# EAGLE design LedTile (EAGLE 7.4.0)
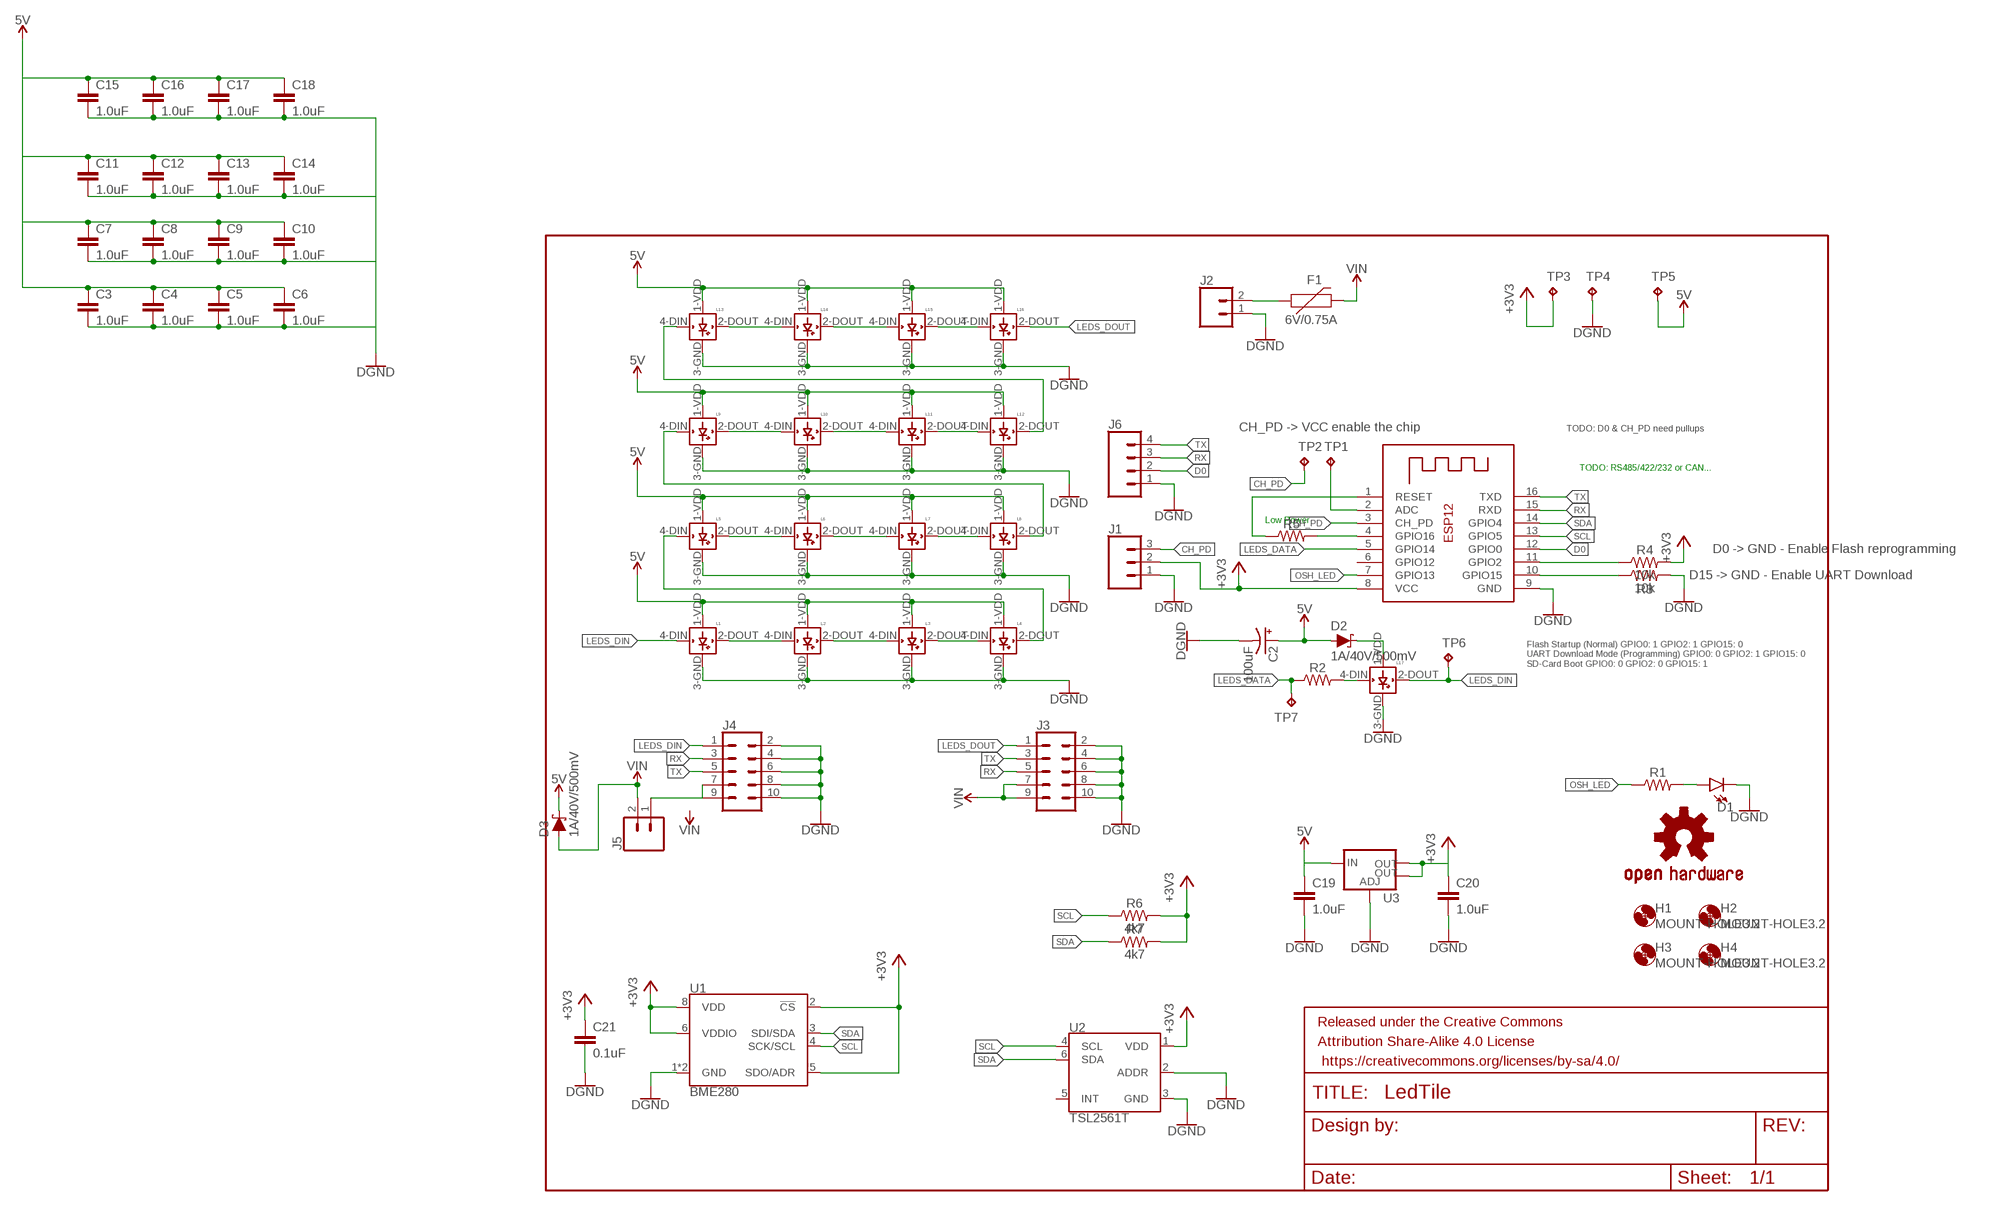
[diagram p0: schematic, sheet 1]

## Parts
C2  100uF  100UF-POLAR-EIA7343-10V-10%(TANT)  [EIA7343]
C3  1.0uF  1.0UF-0805-25V-(+80/-20%)  [0805]
C4  1.0uF  1.0UF-0805-25V-(+80/-20%)  [0805]
C5  1.0uF  1.0UF-0805-25V-(+80/-20%)  [0805]
C6  1.0uF  1.0UF-0805-25V-(+80/-20%)  [0805]
C7  1.0uF  1.0UF-0805-25V-(+80/-20%)  [0805]
C8  1.0uF  1.0UF-0805-25V-(+80/-20%)  [0805]
C9  1.0uF  1.0UF-0805-25V-(+80/-20%)  [0805]
C10  1.0uF  1.0UF-0805-25V-(+80/-20%)  [0805]
C11  1.0uF  1.0UF-0805-25V-(+80/-20%)  [0805]
C12  1.0uF  1.0UF-0805-25V-(+80/-20%)  [0805]
C13  1.0uF  1.0UF-0805-25V-(+80/-20%)  [0805]
C14  1.0uF  1.0UF-0805-25V-(+80/-20%)  [0805]
C15  1.0uF  1.0UF-0805-25V-(+80/-20%)  [0805]
C16  1.0uF  1.0UF-0805-25V-(+80/-20%)  [0805]
C17  1.0uF  1.0UF-0805-25V-(+80/-20%)  [0805]
C18  1.0uF  1.0UF-0805-25V-(+80/-20%)  [0805]
C19  1.0uF  1.0UF-0805-25V-(+80/-20%)  [0805]
C20  1.0uF  1.0UF-0805-25V-(+80/-20%)  [0805]
C21  0.1uF  1.0UF-0805-25V-(+80/-20%)  [0805]
D1  LED1206-BOTTOM  [LED-1206-BOTTOM]
D2  1A/40V/500mV  DIODE-SCHOTTKY-SS14  [SMA-DIODE]
D3  1A/40V/500mV  DIODE-SCHOTTKY-SS14  [SMA-DIODE]
F1  6V/0.75A  PPTC_THREE-QUARTER-AMP  [1206]
FRAME1  FRAME-LETTER  [CREATIVE_COMMONS]
H1  MOUNT-HOLE3.2  [3,2]
H2  MOUNT-HOLE3.2  [3,2]
H3  MOUNT-HOLE3.2  [3,2]
H4  MOUNT-HOLE3.2  [3,2]
J1  CONN_031X03_NO_SILK  [1X03_NO_SILK]
J2  CONN_025MM  [SCREWTERMINAL-5MM-2]
J3  CONN_05X2RA  [2X5-RA]
J4  CONN_05X2RA  [2X5-RA]
J5  CONN_02  [1X02]
J6  CONN_04  [1X04]
L1  WS2812B  [WS2812B]
L2  WS2812B  [WS2812B]
L3  WS2812B  [WS2812B]
L4  WS2812B  [WS2812B]
L5  WS2812B  [WS2812B]
L6  WS2812B  [WS2812B]
L7  WS2812B  [WS2812B]
L8  WS2812B  [WS2812B]
L9  WS2812B  [WS2812B]
L10  WS2812B  [WS2812B]
L11  WS2812B  [WS2812B]
L12  WS2812B  [WS2812B]
L13  WS2812B  [WS2812B]
L14  WS2812B  [WS2812B]
L15  WS2812B  [WS2812B]
L16  WS2812B  [WS2812B]
L17  WS2812B  [WS2812B]
LOGO1  OSHW-LOGOL  [OSHW-LOGO-L]
R1  RESISTOR0805  [0805]
R2  RESISTOR0805  [0805]
R3  10k  RESISTOR0805  [0805]
R4  10k  RESISTOR0805  [0805]
R5  RESISTOR0805  [0805]
R6  4k7  RESISTOR0805  [0805]
R7  4k7  RESISTOR0805  [0805]
TP1  TPTP12R  [TP12R]
TP2  TPTP12R  [TP12R]
TP3  TPTP12R  [TP12R]
TP4  TPTP12R  [TP12R]
TP5  TPTP12R  [TP12R]
TP6  TPTP12R  [TP12R]
TP7  TPTP12R  [TP12R]
U1  BME280  [LGA-8-2.5X2.5]
U2  TSL2561T  [TMB-6]
U3  V_REG_LM1117SOT223  [SOT223]
X1  ESP-12  [ESP-12]

## Nets
5V: C2.A(+) C3.1 C4.1 C5.1 C6.1 C7.1 C8.1 C9.1 C10.1 C11.1 C12.1 C13.1 C14.1 C15.1 C16.1 C17.1 C18.1 C19.1 D2.A D3.C L1.1-VDD(VDD) L2.1-VDD(VDD) L3.1-VDD(VDD) L4.1-VDD(VDD) L5.1-VDD(VDD) L6.1-VDD(VDD) L7.1-VDD(VDD) L8.1-VDD(VDD) L9.1-VDD(VDD) L10.1-VDD(VDD) L11.1-VDD(VDD) L12.1-VDD(VDD) L13.1-VDD(VDD) L14.1-VDD(VDD) L15.1-VDD(VDD) L16.1-VDD(VDD) TP5.TP U3.3(IN)
+3V3: C20.1 C21.1 J1.2 R4.2 R6.2 R7.2 TP3.TP U1.2(!CS) U1.5(SDO/ADR) U1.6(VDDIO) U1.8(VDD) U2.1(VDD) U3.2(OUT) U3.4(OUT) X1.8(VCC)
CH_PD: J1.3 TP2.TP X1.3(CH_PD)
D0: J6.2 X1.12(GPIO0)
GND: C2.C(-) C3.2 C4.2 C5.2 C6.2 C7.2 C8.2 C9.2 C10.2 C11.2 C12.2 C13.2 C14.2 C15.2 C16.2 C17.2 C18.2 C19.2 C20.2 C21.2 D1.C J1.1 J2.1 J3.2 J3.4 J3.6 J3.8 J3.10 J4.2 J4.4 J4.6 J4.8 J4.10 J6.1 L1.3-GND(GND) L2.3-GND(GND) L3.3-GND(GND) L4.3-GND(GND) L5.3-GND(GND) L6.3-GND(GND) L7.3-GND(GND) L8.3-GND(GND) L9.3-GND(GND) L10.3-GND(GND) L11.3-GND(GND) L12.3-GND(GND) L13.3-GND(GND) L14.3-GND(GND) L15.3-GND(GND) L16.3-GND(GND) L17.3-GND(GND) R3.2 TP4.TP U1.1(GND) U1.7(GND) U2.2(ADDR) U2.3(GND) U3.1(ADJ) X1.9(GND) ; supply symbol labelled DGND
LEDS_DATA: R2.1 TP7.TP X1.5(GPIO14)
LEDS_DIN: J4.1 L1.4-DIN(DIN) L17.2-DOUT(DOUT) TP6.TP
LEDS_DOUT: J3.1 L16.2-DOUT(DOUT)
N$1: L1.2-DOUT(DOUT) L2.4-DIN(DIN)
N$2: L2.2-DOUT(DOUT) L3.4-DIN(DIN)
N$3: L4.2-DOUT(DOUT) L5.4-DIN(DIN)
N$4: D2.C L17.1-VDD(VDD)
N$5: TP1.TP X1.2(ADC)
N$6: L17.4-DIN(DIN) R2.2
N$7: L3.2-DOUT(DOUT) L4.4-DIN(DIN)
N$8: L13.2-DOUT(DOUT) L14.4-DIN(DIN)
N$9: L14.2-DOUT(DOUT) L15.4-DIN(DIN)
N$10: L15.2-DOUT(DOUT) L16.4-DIN(DIN)
N$11: L11.2-DOUT(DOUT) L12.4-DIN(DIN)
N$12: L12.2-DOUT(DOUT) L13.4-DIN(DIN)
N$13: L8.2-DOUT(DOUT) L9.4-DIN(DIN)
N$14: L10.2-DOUT(DOUT) L11.4-DIN(DIN)
N$15: L9.2-DOUT(DOUT) L10.4-DIN(DIN)
N$16: L5.2-DOUT(DOUT) L6.4-DIN(DIN)
N$17: L6.2-DOUT(DOUT) L7.4-DIN(DIN)
N$18: L7.2-DOUT(DOUT) L8.4-DIN(DIN)
N$19: R3.1 X1.10(GPIO15)
N$20: R4.1 X1.11(GPIO2)
N$24: R5.2 X1.4(GPIO16)
N$25: R5.1 X1.1(RESET)
N$26: D1.A R1.2
N$27: J4.7 J4.9 J5.1
N$28: F1.1 J2.2
OSH_LED: R1.1 X1.7(GPIO13)
RX: J3.5 J4.3 J6.3 X1.15(RXD)
SCL: R6.1 U1.4(SCK/SCL) U2.4(SCL) X1.13(GPIO5)
SDA: R7.1 U1.3(SDI/SDA) U2.6(SDA) X1.14(GPIO4)
TX: J3.3 J4.5 J6.4 X1.16(TXD)
VIN: D3.A F1.2 J3.7 J3.9 J5.2
Unconnected: U2.5(INT) X1.6(GPIO12)

## Notes on the sheet
- CH_PD -> VCC enable the chip | TODO: D0 & CH_PD need pullups
- TODO: RS485/422/232 or CAN...
- Low Power
- D0 -> GND - Enable Flash reprogramming
- D15 -> GND - Enable UART Download
- Flash Startup (Normal) GPIO0: 1 GPIO2: 1 GPIO15: 0
  UART Download Mode (Programming) GPIO0: 0 GPIO2: 1 GPIO15: 0
  SD-Card Boot GPIO0: 0 GPIO2: 0 GPIO15: 1

## Library data of the parts
C2 = SparkFun-Capacitors:100UF-POLAR: 100µF polarized capacitors A capacitor is a passive two-terminal electrical component used to store electrical energy temporarily in an electric field.; PROD_ID: CAP-07890
C3-C20 = SparkFun-Capacitors:1.0UF: 1µF ceramic capacitors A capacitor is a passive two-terminal electrical component used to store electrical energy temporarily in an electric field.; PROD_ID: CAP-11625
C21 = SparkFun-Capacitors:1.0UF: 1µF ceramic capacitors A capacitor is a passive two-terminal electrical component used to store electrical energy temporarily in an electric field.; PROD_ID: CAP-11625; VALUE: 1.0uF
D1 = SparkFun-LED:LED: LED (Generic) Standard schematic elements and footprints for 5mm, 3mm, 1206, and 0603 sized LEDs. Generic LEDs with no color specified.
D2 D3 = SparkFun-DiscreteSemi:DIODE-SCHOTTKY: Schottky diode A Schottky diode is a semiconductor diode which has a low forward voltage drop and a very fast switching action.; PROD_ID: DIO-08053
F1 = SparkFun-Fuses:PPTC: Resettable Fuse PPTC Resettable Fuse. Really a sort of resistor with a polymeric positive temperature coefficient whose resistance increases dramatically with an increase in temperature. When heated by the power passing through the resistance rises causing the current to be limited, protecting the circuit. This is achieved by the transition of the polymer from a crystalline to an amorphous state where the conductive carbon separates breaking the conductive pathways found in the cool crystalline structure. When a PPTC cools back down it resumes conducting letting the circuit turn back on. SparkFun Products: SparkFun RedBoard - Programmed with Arduino <https://www.sparkfun.com/products/12757> Pro Micro - 5V/16MHz <https://www.sparkfun.com/products/12640> Arduino Pro 328 - 5V/16MHz <https://www.sparkfun.com/products/10915> MP3 Trigger <https://www.sparkfun.com/products/13720>; PROD_ID: RES-11150
FRAME1 = SparkFun-Aesthetics:FRAME-LETTER: Schematic Frame - Letter Standard 8.5x11 US Letter frame
H1-H4 = holes:MOUNT-HOLE: MOUNTING HOLE with drill center marker
J1 = SparkFun-Connectors:CONN_03: Multi connection point. Often used as Generic Header-pin footprint for 0.1 inch spaced/style header connections On any of the 0.1 inch spaced packages, you can populate with these: Break Away Headers - Straight <https://www.sparkfun.com/products/116> (PRT-00116) Break Away Male Headers - Right Angle <https://www.sparkfun.com/products/553> (PRT-00553) Female Headers <https://www.sparkfun.com/products/115> (PRT-00115) Break Away Headers - Machine Pin <https://www.sparkfun.com/products/117> (PRT-00117) Break Away Female Headers - Swiss Machine Pin <https://www.sparkfun.com/products/743> (PRT-00743) Stackable Header - 3 Pin (Female, 0.1") <https://www.sparkfun.com/products/13875> (PRT-13875) For SCREWTERMINALS and SPRING TERMINALS visit here: Screw Terimnals on SparkFun.com <https://www.sparkfun.com/search/results?term=Screw+Terminals> (5mm/3.5mm/2.54mm spacing) This device is also useful as a general connection point to wire up your design to another part of your project. Our various solder wires solder well into these plated through hole pads. Hook-Up Wire - Assortment (Stranded, 22 AWG) <https://www.sparkfun.com/products/11375> (PRT-11375) Hook-Up Wire - Assortment (Solid Core, 22 AWG) <https://www.sparkfun.com/products/11367> (PRT-11367) View the entire wire category on our website here <https://www.sparkfun.com/categories/141> Special notes: Molex polarized connector foot print use with SKU : PRT-08232 with associated crimp pins and housings.
J2 = SparkFun-Connectors:CONN_02: Multi connection point. Often used as Generic Header-pin footprint for 0.1 inch spaced/style header connections On any of the 0.1 inch spaced packages, you can populate with these: Break Away Headers - Straight <https://www.sparkfun.com/products/116> (PRT-00116) Break Away Male Headers - Right Angle <https://www.sparkfun.com/products/553> (PRT-00553) Female Headers <https://www.sparkfun.com/products/115> (PRT-00115) Break Away Headers - Machine Pin <https://www.sparkfun.com/products/117> (PRT-00117) Break Away Female Headers - Swiss Machine Pin <https://www.sparkfun.com/products/743> (PRT-00743) For SCREWTERMINALS and SPRING TERMINALS visit here: Screw Terimnals on SparkFun.com <https://www.sparkfun.com/search/results?term=Screw+Terminals> (5mm/3.5mm/2.54mm spacing) This device is also useful as a general connection point to wire up your design to another part of your project. Our various solder wires solder well into these plated through hole pads. Hook-Up Wire - Assortment (Stranded, 22 AWG) <https://www.sparkfun.com/products/11375> (PRT-11375) Hook-Up Wire - Assortment (Solid Core, 22 AWG) <https://www.sparkfun.com/products/11367> (PRT-11367) View the entire wire category on our website here <https://www.sparkfun.com/categories/141> Special notes: Molex polarized connector foot print use with: PRT-08233 with associated crimp pins and housings. 2.54_SCREWTERM for use with PRT-10571. 3.5mm Screw Terminal footprints for PRT-08084 5mm Screw Terminal footprints for use with PRT-08432; SF_SKU: PRT-08432
J3 J4 = SparkFun-Connectors:CONN_05X2: Multi connection point. Often used as Generic Header-pin footprint for 0.1 inch spaced/style header connections For AVR SPI programming port, see special device with nice symbol: "AVR_SPI_PROG_5x2.dev" You can populate with any combo of single row headers, but if you'd like an exact match, check these: 2x5 AVR ICSP Male Header <https://www.sparkfun.com/products/778> (PRT-00778) 2x5 Pin Shrouded Header <https://www.sparkfun.com/products/8506> (PRT-08506) On any of the 0.1 inch spaced packages, you can populate with these: Break Away Headers - Straight <https://www.sparkfun.com/products/116> (PRT-00116) Break Away Male Headers - Right Angle <https://www.sparkfun.com/products/553> (PRT-00553) Female Headers <https://www.sparkfun.com/products/115> (PRT-00115) Break Away Headers - Machine Pin <https://www.sparkfun.com/products/117> (PRT-00117) Break Away Female Headers - Swiss Machine Pin <https://www.sparkfun.com/products/743> (PRT-00743) Special note: the shrouded connector mates well with our 5x2 ribbon cables: 2x5 Pin IDC Ribbon Cable <https://www.sparkfun.com/products/8535> (PRT-08535)
J5 = SparkFun-Connectors:CONN_02: Multi connection point. Often used as Generic Header-pin footprint for 0.1 inch spaced/style header connections On any of the 0.1 inch spaced packages, you can populate with these: Break Away Headers - Straight <https://www.sparkfun.com/products/116> (PRT-00116) Break Away Male Headers - Right Angle <https://www.sparkfun.com/products/553> (PRT-00553) Female Headers <https://www.sparkfun.com/products/115> (PRT-00115) Break Away Headers - Machine Pin <https://www.sparkfun.com/products/117> (PRT-00117) Break Away Female Headers - Swiss Machine Pin <https://www.sparkfun.com/products/743> (PRT-00743) For SCREWTERMINALS and SPRING TERMINALS visit here: Screw Terimnals on SparkFun.com <https://www.sparkfun.com/search/results?term=Screw+Terminals> (5mm/3.5mm/2.54mm spacing) This device is also useful as a general connection point to wire up your design to another part of your project. Our various solder wires solder well into these plated through hole pads. Hook-Up Wire - Assortment (Stranded, 22 AWG) <https://www.sparkfun.com/products/11375> (PRT-11375) Hook-Up Wire - Assortment (Solid Core, 22 AWG) <https://www.sparkfun.com/products/11367> (PRT-11367) View the entire wire category on our website here <https://www.sparkfun.com/categories/141> Special notes: Molex polarized connector foot print use with: PRT-08233 with associated crimp pins and housings. 2.54_SCREWTERM for use with PRT-10571. 3.5mm Screw Terminal footprints for PRT-08084 5mm Screw Terminal footprints for use with PRT-08432
J6 = SparkFun-Connectors:CONN_04: Multi connection point. Often used as Generic Header-pin footprint for 0.1 inch spaced/style header connections On any of the 0.1 inch spaced packages, you can populate with these: Break Away Headers - Straight <https://www.sparkfun.com/products/116> (PRT-00116) Break Away Male Headers - Right Angle <https://www.sparkfun.com/products/553> (PRT-00553) Female Headers <https://www.sparkfun.com/products/115> (PRT-00115) Break Away Headers - Machine Pin <https://www.sparkfun.com/products/117> (PRT-00117) Break Away Female Headers - Swiss Machine Pin <https://www.sparkfun.com/products/743> (PRT-00743) For SCREWTERMINALS and SPRING TERMINALS visit here: Screw Terimnals on SparkFun.com <https://www.sparkfun.com/search/results?term=Screw+Terminals> (5mm/3.5mm/2.54mm spacing) This device is also useful as a general connection point to wire up your design to another part of your project. Our various solder wires solder well into these plated through hole pads. Hook-Up Wire - Assortment (Stranded, 22 AWG) <https://www.sparkfun.com/products/11375> (PRT-11375) Hook-Up Wire - Assortment (Solid Core, 22 AWG) <https://www.sparkfun.com/products/11367> (PRT-11367) View the entire wire category on our website here <https://www.sparkfun.com/categories/141> Special notes: Molex polarized connector foot print use with SKU : PRT-08231 with associated crimp pins and housings. 1MM SMD Version SKU: PRT-10208; PROD_ID: CONN-09696
L1-L17 = adafruit:WS2812B
LOGO1 = Spark:OSHW-LOGO: Open Source Hardware Logo This logo indicates the piece of hardware it is found on incorporates a OSHW license and/or adheres to the definition of open source hardware found here: http://freedomdefined.org/OSHW
R1-R7 = SparkFun-Resistors:RESISTOR: Generic Resistor Package
TP1-TP7 = testpad:TP: Test pad
U1 = SparkFun-Sensors:BME280: Bosch BME280 – Combined Humidity and Pressure Sensor The BME280 is as combined digital humidity, pressure and temperature sensor based on proven sensing principles. The sensor module is housed in an extremely compact metal-lid LGA package with a footprint of only 2.5×2.5mm² with a height of 0.93mm. Its small dimensions and its low power consumption allow the implementation in battery driven devices such as handsets, GPS modules or watches. Datasheet <https://cdn.sparkfun.com/assets/learn_tutorials/4/1/9/BST-BME280_DS001-10.pdf> SparkFun Products SparkFun Atmospheric Sensor Breakout - BME280 <https://www.sparkfun.com/products/13676> (SEN-13676); PROD_ID: IC-13090
U2 = SparkFun-Sensors:TSL2561: TAOS TSL2561 Digital Luminosity (Light) Sensor The TSL2561 is a light-to-digital converter that transform light intensity to a digital signal output via I2C interface. The device combines one broadband photodiode (visible plus infrared) and one infrared-responding photodiode on a single CMOS integrated circuit capable of providing a near-photopic response over an effective 20-bit dynamic range (16-bit resolution). Two integrating ADCs convert the photodiode currents to a digital output that represents the irradiance measured on each channel. This digital output can be input to a microprocessor where illuminance (ambient light level) in lux is derived using an empirical formula to approximate the human eye response. The TSL2561 device supports a traditional level style interrupt that remains asserted until the firmware clears it. Datasheet <http://www.mouser.com/ds/2/588/ams_sl2560-e58-488842.pdf> SparkFun Products SparkFun Luminosity Sensor Breakout - TSL2561 <https://www.sparkfun.com/products/12055> (SEN-12055)
U3 = SparkFun-IC-Power:V_REG_LM1117: Voltage Regulator LM1117 Standard adjustable voltage regulator but in SMD form. Spark Fun Electronics SKU : COM-00595; PROD_ID: VREG-08170
X1 = adafruit:ESP-12

## Board
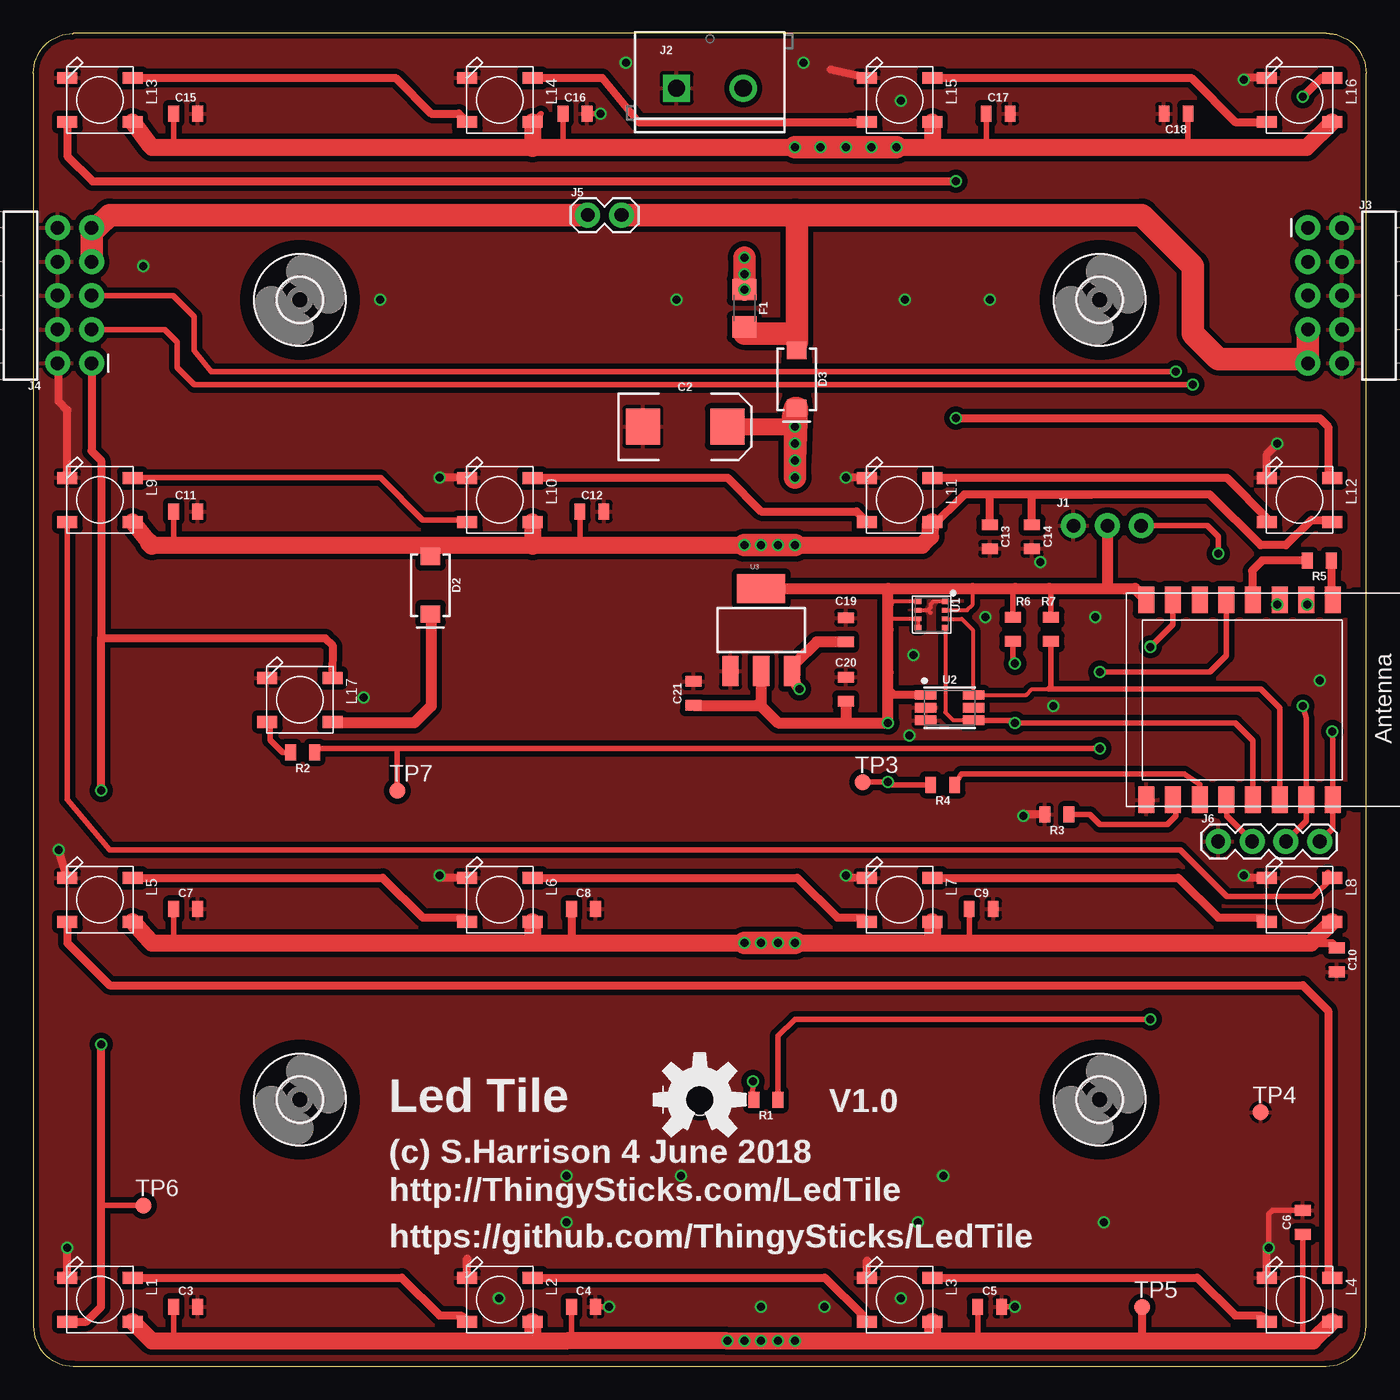
[diagram p1: board, top side]
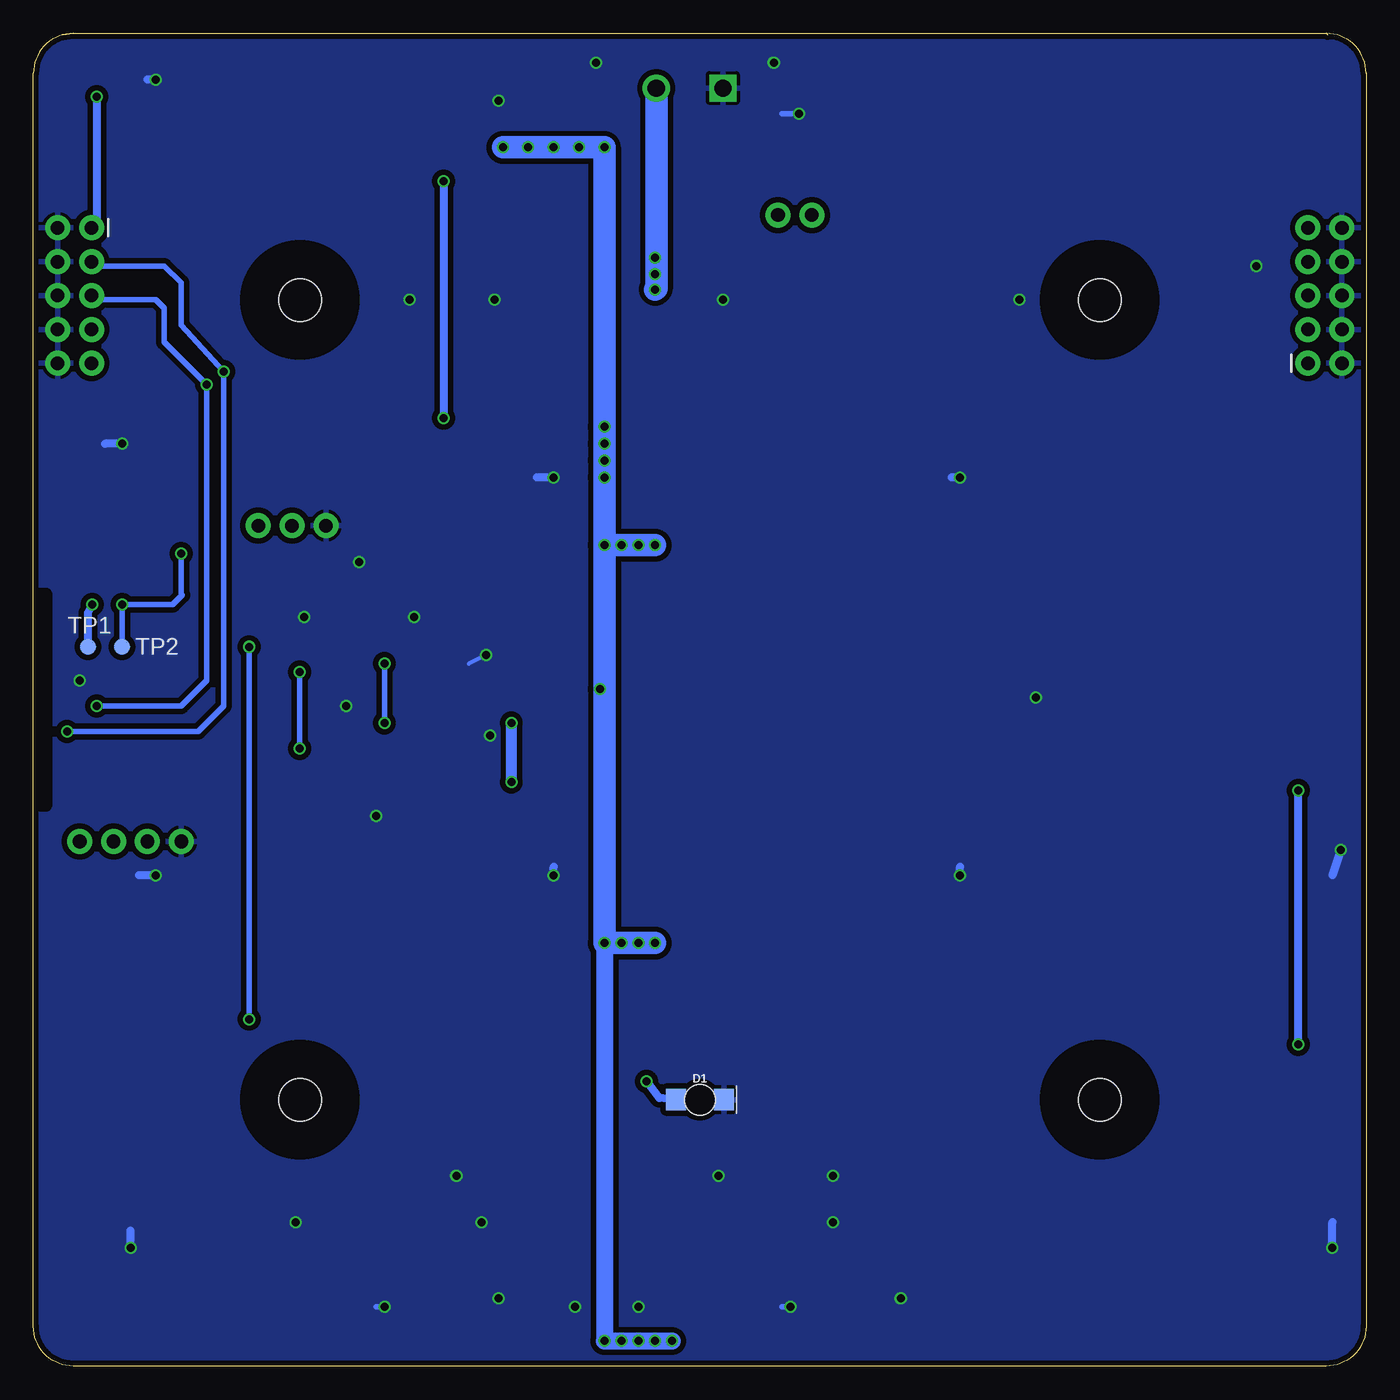
[diagram p2: board, bottom side, seen from below]

Size 100 x 100 mm. Coordinates in mm from the lower left corner, seen from the top.
Outline: 97,100 3,100
Outline: 3,100 arc90 0,97 0,3 arc90 3,0 97,0 arc90 100,3 100,97 arc90 97,100
Outline: 3,100 2.9,99.9
Outline: 97.8,99.9 97,100
Copper layers (1*16): Top 0.035mm / dielectric 1.5mm / Bottom 0.035mm
Design rules "dirt_cheap_dirty_boards.v1 *": minimum track width 5mil, minimum drill 12mil, track to track 5mil, track to pad 5mil, pad to pad 5mil, via to via 5mil, smd to smd 0mil, copper to edge 10mil, drill to drill 10mil, minimum pad ring 12mil, minimum via ring 6mil, stop-mask expansion 2mil, vias tented up to drill 25mil, thermal gap 10mil

### Footprints (pad centres in the part's own frame; a part is rotated, then mirrored left to right if it is on the bottom)
EIA7343 = smd 2.55 x 2.7: A 3.17,0; C -3.17,0
0805 = smd 0.8 x 1.2: 1 -0.9,0; 2 0.9,0
LED-1206-BOTTOM = smd 1.5 x 1.6: A -1.8,0; C 1.8,0 | hole 2.3: 0,0
SMA-DIODE = smd 1.27 x 1.47: A -2.15,0; C 2.15,0
1206 = smd 1.6 x 1.8: 1 -1.4,0; 2 1.4,0
3,2 = hole 3.2: 0,0
1X03_NO_SILK = drill 1.016 pad 1.88: 1 0,0; 2 2.54,0; 3 5.08,0
SCREWTERMINAL-5MM-2 = drill 1.3 pad 2.032 square: 1 0,0 | drill 1.3 pad 2.032: 2 5,0
2X5-RA = drill 1.016 pad 1.88: 1 -1.27,5.08; 2 1.27,5.08; 3 -1.27,2.54; 4 1.27,2.54; 5 -1.27,0; 6 1.27,0; 7 -1.27,-2.54; 8 1.27,-2.54; 9 -1.27,-5.08; 10 1.27,-5.08
1X02 = drill 1.016 pad 1.88: 1 0,0; 2 2.54,0
1X04 = drill 1.016 pad 1.88: 1 0,0; 2 2.54,0; 3 5.08,0; 4 7.62,0
WS2812B = smd 1.5 x 0.9: 1-VDD 2.45,-1.65; 2-DOUT 2.45,1.65; 3-GND -2.45,1.65; 4-DIN -2.45,-1.65
TP12R = smd 1.2 x 1.2: TP 0,0
LGA-8-2.5X2.5 = smd 0.35 x 0.5: 1 -0.975,1.025; 2 -0.325,1.025; 3 0.325,1.025; 4 0.975,1.025; 5 0.975,-1.025; 6 0.325,-1.025; 7 -0.325,-1.025; 8 -0.975,-1.025
TMB-6 = smd 1.6 x 0.7: 1 -1.8,0.95; 2 -1.8,0; 3 -1.8,-0.95; 4 1.8,-0.95; 5 1.8,0; 6 1.8,0.95
SOT223 = smd 1.219 x 2.235: 1 -2.311,-3.099; 2 0,-3.099; 3 2.311,-3.099 | smd 3.6 x 2.2: 4 0,3.099
ESP-12 = smd 2 x 1.2: 1 -7.5,4.5; 2 -7.5,2.5; 3 -7.5,0.5; 4 -7.5,-1.5; 5 -7.5,-3.5; 6 -7.5,-5.5; 7 -7.5,-7.5; 8 -7.5,-9.5; 9 7.5,-9.5; 10 7.5,-7.5; 11 7.5,-5.5; 12 7.5,-3.5; 13 7.5,-1.5; 14 7.5,0.5; 15 7.5,2.5; 16 7.5,4.5

### Placement (x,y rotation side)
C2  48.9,70.48 0 top
C3  11.43,4.45 0 top
C4  41.27,4.45 0 top
C5  71.75,4.45 0 top
C6  95.25,10.79 90 top
C7  11.43,34.29 0 top
C8  41.27,34.29 0 top
C9  71.12,34.29 0 top
C10  97.79,30.48 270 top
C11  11.43,64.14 0 top
C12  41.91,64.14 0 top
C13  71.75,62.23 270 top
C14  74.93,62.23 270 top
C15  11.43,93.98 0 top
C16  40.64,93.98 0 top
C17  72.39,93.98 0 top
C18  85.72,93.98 180 top
C19  60.96,55.24 90 top
C20  60.96,50.8 90 top
C21  49.53,50.48 90 top
D1  50,20 0 bottom
D2  29.8,58.59 270 top
D3  57.27,74.05 270 top
F1  53.34,79.38 270 top
FRAME1  17,-18.93 0 top  (outside the outline)
H1  80,80 0 top
H2  80,20 0 top
H3  20,80 0 top
H4  20,20 0 top
J1  78.05,63.06 0 top
J2  48.26,95.89 0 top
J3  96.91,80.33 0 top
J4  3.1,80.33 180 top
J5  41.59,86.36 0 top
J6  88.9,39.37 0 top
L1  5,5 0 top
L2  35,5 0 top
L3  65,5 0 top
L4  95,5 0 top
L5  5,35 0 top
L6  35,35 0 top
L7  65,35 0 top
L8  95,35 0 top
L9  5,65 0 top
L10  35,65 0 top
L11  65,65 0 top
L12  95,65 0 top
L13  5,95 0 top
L14  35,95 0 top
L15  65,95 0 top
L16  95,95 0 top
L17  20,50 0 top
LOGO1  50,20 0 top
R1  54.97,20 180 top
R2  20.2,46.05 180 top
R3  [0805]  76.8,41.39 180 top
R4  [0805]  68.22,43.62 180 top
R5  96.48,60.45 180 top
R6  73.48,55.28 90 top
R7  76.34,55.28 90 top
TP1  95.89,53.98 0 bottom
TP2  93.34,53.98 0 bottom
TP3  62.23,43.81 0 top
TP4  92.08,19.05 0 top
TP5  83.19,4.45 0 top
TP6  8.26,12.06 0 top
TP7  27.3,43.18 0 top
U1  67.39,56.4 270 top
U2  68.75,49.41 0 top
U3  54.61,55.24 0 top
X1  93,50 270 top

### Tracks (layer width: path | path; a pad name or v marks a point on that pad's centre or on a via)
5V  (via drill 0.6)
  Top 0.406: C18.1 86.62,91.81 87,91.44 | C17.1 71.49,91.7 71.75,91.44 | 38.08,93.98 L14.1-VDD | C11.1 10.53,61.97 10.16,61.59 | C15.1 10.53,91.7 10.79,91.44 | C16.1 39.74,91.7 40.01,91.44 | C12.1 41.01,61.86 41.27,61.59 | C7.1 10.53,32.12 10.16,31.75 | 40.38,32.02 40.64,31.75 | C9.1 70.22,32.12 69.85,31.75 | C3.1 10.53,2.27 10.16,1.91 | C4.1 40.38,2.27 40.01,1.91 | C5.1 70.86,2.17 71.12,1.91 | C6.1 95.25,1.91 | 79.38,65.39 77.47,65.41
  Top 0.61: L12.1-VDD 97.3,63.5 95.89,63.5 93.98,61.59 92.08,61.59 88.27,65.41 77.47,65.41 71.75,65.41 | 71.75,65.41 69.85,65.41 67.31,62.87 | TP5.TP 83.19,1.91 | D2.A 29.8,61.55 29.84,61.59 | C13.1 71.75,65.41 | C14.1 74.93,65.39 79.38,65.39 | C8.1 40.38,32.12 40.01,31.75 | 95.85,31.75 97.42,31.75 C10.1
  Top 0.813: v57.47,50.8 56.92,51.52 U3.3 57.15,51.92 | C19.1 58.79,54.34 57.15,52.7 57.15,51.92 | 57.15,51.44 57.15,51.92
  Top 1.27: 67.31,1.91 v57.15,1.91 v55.88,1.91 v54.61,1.91 v53.34,1.91 v52.07,1.91 40.01,1.91 37.47,1.91 | 67.31,1.91 71.12,1.91 83.19,1.91 95.25,1.91 96,1.91 L4.1-VDD | 37.47,1.91 10.16,1.91 8.89,1.91 L1.1-VDD | L5.1-VDD 8.72,31.92 8.89,31.75 10.16,31.75 37.47,31.75 | 37.47,31.75 40.01,31.75 40.64,31.75 v53.34,31.75 | v57.15,31.75 67.31,31.75 | 67.31,31.75 69.85,31.75 95.85,31.75 L8.1-VDD | L9.1-VDD 8.72,61.77 | 8.89,61.59 10.16,61.59 29.84,61.59 37.47,61.59 41.27,61.59 v53.34,61.59 | L13.1-VDD 8.72,91.61 8.89,91.44 10.79,91.44 37.47,91.44 40.01,91.44 v57.15,91.44 | L16.1-VDD 95.54,91.44 87,91.44 71.75,91.44 67.31,91.44 | L14.1-VDD 37.45,91.45 | L10.1-VDD 37.45,61.61 | C2.A v57.15,70.48 | L3.1-VDD 67.45,2.04 67.31,1.91 | L2.1-VDD 37.45,1.92 37.47,1.91 | L6.1-VDD 37.45,31.77 37.47,31.75 | L7.1-VDD 67.45,31.89 67.31,31.75 | v57.15,61.59 66.67,61.59 67.31,62.23 67.31,62.87 67.31,63.21 L11.1-VDD | v64.77,91.44 67.31,91.44 | L15.1-VDD 67.45,91.58 67.31,91.44
  Top 1.422: 8.72,61.77 8.89,61.59 | 37.45,91.45 37.47,91.44 | 37.45,61.61 37.47,61.59
  Top 1.676: v53.34,31.75 v54.61,31.75 v55.88,31.75 v57.15,31.75 | v53.34,61.59 v54.61,61.59 v55.88,61.59 v57.15,61.59 | v57.15,91.44 v59.05,91.44 v60.96,91.44 v62.87,91.44 v64.77,91.44 | v57.15,67.94 D3.C 57.15,71.89 57.01,71.12 | v57.15,66.67 v57.15,67.94 | v57.15,67.94 v57.15,69.22 v57.15,70.48
  Bottom 0.813: v57.47,50.8 57.15,50.8
  Bottom 1.27: v57.15,31.75 v57.15,1.91 v55.88,1.91 v54.61,1.91 v53.34,1.91 v52.07,1.91
  Bottom 1.676: v57.15,70.48 v57.15,69.22 v57.15,67.94 v57.15,66.67 | v57.15,66.67 v57.15,61.59 | v57.15,61.59 57.15,50.8 v57.15,31.75 v53.34,31.75 | v64.77,91.44 v62.87,91.44 v60.96,91.44 v59.05,91.44 v57.15,91.44 v57.15,66.67 | v57.15,61.59 v53.34,61.59
+3V3  (via drill 0.6)
  Top 0.305: 64.14,55.24 64.33,56.07 U1.6 U1.5 | U1.8 64.55,57.37 64.14,57.15 | U1.2 70.06,56.72 70.48,57.15 70.48,58.34
  Top 0.406: R4.2 64.33,43.62 v64.14,43.81 TP3.TP | R6.2 73.48,58.16 73.66,58.34 | R7.2 76.34,58.2 76.2,58.34
  Top 0.61: U2.1 64.58,50.36 64.14,50.8 64.14,52.07
  Top 0.813: U3.4 64.14,58.34 | 64.14,58.34 70.48,58.34 73.66,58.34 76.2,58.34 80.64,58.34 | 80.64,58.34 82.66,58.34 X1.8 | 64.14,58.34 64.14,57.15 64.14,55.24 64.14,52.07 v64.14,48.26 60.96,48.26 | U3.2 54.61,49.53 | 54.61,49.53 55.88,48.26 60.96,48.26 | C20.1 60.96,48.26 | J1.2 80.58,58.4 80.64,58.34 | C21.1 54.24,49.58 54.61,49.53
  Bottom 0.813: v64.14,43.81 v64.14,48.26
CH_PD  (via drill 0.6)
  Top 0.406: v93.34,57.15 93.34,57.34 X1.3 | J1.3 88.06,63.06 88.9,62.23 v88.9,60.96
  Bottom 0.406: v88.9,60.96 88.9,57.91 88.84,57.84 89.53,57.15 v93.34,57.15 TP2.TP
D0
  Top 0.406: X1.12 89.53,42.47 89.53,41.27 J6.2
GND  (via drill 0.6)
  Top 0.305: U1.7 67.11,56.72 | 67.11,56.72 67.31,56.52 | U1.1 67.53,57.37 67.31,57.15 67.31,56.92 67.11,56.72
  Top 0.406: C16.2 v42.55,93.98 | C6.2 92.97,11.7 92.71,11.43 v92.71,8.89 | C5.2 v73.66,4.45 | C4.2 v43.18,4.45
  Top 0.61: L12.3-GND 92.55,68.42 v93.34,69.22 | L11.3-GND 60.98,66.65 v60.96,66.67 | L10.3-GND 30.5,66.65 v30.48,66.67 | L9.3-GND 2.55,71.75 1.91,72.39 1.91,75.17 J4.2 | L8.3-GND 90.98,36.65 v90.81,36.83 | L2.3-GND 32.55,8.09 | L1.3-GND v2.55,8.88 v2.54,8.89 | L3.3-GND 62.55,7.93 | L4.3-GND 92.55,8.73 v92.71,8.89 | L6.3-GND 30.66,36.65 v30.48,36.83 | L7.3-GND 61.14,36.65 v60.96,36.83 | L16.3-GND 90.94,96.65 v90.81,96.52 | L15.3-GND 59.82,97.28 | L5.3-GND v1.92,38.73 v1.91,38.73 | R3.2 74.41,41.39 v74.3,41.27
  Bottom 0.305: v66.04,53.34 67.31,52.7
  Bottom 0.406: v42.55,93.98 43.81,93.98 | v73.66,4.45 74.3,4.45 | v43.18,4.45 43.81,4.45
  Bottom 0.61: v93.34,69.22 94.61,69.22 | v60.96,66.67 62.23,66.67 | v30.48,66.67 31.11,66.67 | v90.81,36.83 92.08,36.83 | v2.54,8.89 2.54,10.79 | v92.71,8.89 92.71,10.16 | v30.48,36.83 30.48,37.47 | v60.96,36.83 60.96,37.47 | v90.81,96.52 91.44,96.52 | v1.91,38.73 2.54,36.83
  other vias: 34.92,5.08 65.09,5.08 65.09,94.93 24.77,50.16 65.72,47.31 71.75,80.01 65.41,80.01 26.04,80.01 48.26,80.01 8.26,82.55 71.44,56.2 96.52,51.44 57.78,97.79 44.45,97.79 75.56,60.33 76.52,49.53 79.69,56.2 59.37,4.45 54.61,4.45 48.58,14.29 68.26,14.29 40.01,14.29 66.36,10.79 80.33,10.79 40.01,10.79
  pour Top (isolate 0.406, rank 4): -0.1,100.1 100.3,100.2 100.4,0 0,-0.1
  pour Bottom (isolate 0.406, rank 4): -0.64,0 99.69,0 101.6,1.91 101.6,99.06 99.06,101.6 2.54,101.6 -1.91,97.16 -1.91,2.54
LEDS_DATA  (via drill 0.6)
  Top 0.406: X1.5 89.5,53.3 88.27,52.07 v80.01,52.07 | v80.01,46.35 27.3,46.35 | 27.3,46.35 21.41,46.35 R2.1 | TP7.TP 27.3,46.35
  Bottom 0.406: v80.01,52.07 v80.01,46.35
LEDS_DIN  (via drill 0.6)
  Top 0.406: TP6.TP 5.08,12.06
  Top 0.61: L1.4-DIN 3.98,3.35 5.08,4.45 5.08,12.06 v5.08,24.13 | v5.08,43.18 5.08,54.61 | J4.1 4.37,68.66 5.08,67.94 5.08,54.61 | L17.2-DOUT 22.49,54.03 21.91,54.61 5.08,54.61
  Bottom 0.61: v5.08,24.13 v5.08,43.18
LEDS_DOUT  (via drill 0.6)
  Top 0.61: L16.2-DOUT 96.65,96.65 v95.25,95.25
  Bottom 0.61: v95.25,95.25 95.25,85.79 J3.1
N$1
  Top 0.61: L1.2-DOUT 27.64,6.65 30.48,3.81 32.09,3.81 L2.4-DIN
N$2
  Top 0.61: L2.2-DOUT 59.39,6.65 62.23,3.81 62.09,3.81 L3.4-DIN
N$3
  Top 0.61: L5.4-DIN 2.55,31.74 5.71,28.57 95.25,28.57 97.16,26.67 97.16,6.95 L4.2-DOUT
N$4
  Top 0.61: 29.84,56.38 D2.C
  Top 0.813: L17.1-VDD 22.54,48.26 28.57,48.26 29.84,49.53 29.84,56.38
N$5  (via drill 0.6)
  Top 0.61: v95.57,57.15 95.25,57.75 X1.2
  Bottom 0.61: TP1.TP 95.89,56.52 v95.57,57.15
N$6
  Top 0.406: R2.2 18.72,46.05 17.78,46.99 17.78,48.12 L17.4-DIN
N$7
  Top 0.61: L3.2-DOUT 87.33,6.65 90.17,3.81 92.09,3.81 L4.4-DIN
N$8
  Top 0.61: L13.2-DOUT 27.18,96.65 29.84,93.98 31.92,93.98 L14.4-DIN
N$9
  Top 0.61: L14.2-DOUT 42.67,96.65 45.4,93.34 61.28,93.34 L15.4-DIN
N$10
  Top 0.61: L15.2-DOUT 86.86,96.65 90.17,93.34 L16.4-DIN
N$11
  Top 0.61: L12.4-DIN 92.4,63.5 92.71,63.5 89.56,66.65 L11.2-DOUT
N$12  (via drill 0.6)
  Top 0.61: L13.4-DIN 2.55,90.8 4.45,88.9 v69.22,88.9 | v69.22,71.12 96.52,71.12 97.16,70.48 97.16,66.94 L12.2-DOUT
  Bottom 0.61: v69.22,88.9 v69.22,71.12
N$13
  Top 0.406: L9.4-DIN 2.55,42.53 5.71,38.73 86.04,38.73 89.53,35.24 96.04,35.24 L8.2-DOUT
  Top 0.61: 97.16,36.95 L8.2-DOUT
N$14
  Top 0.61: L10.2-DOUT 52.09,66.65 54.61,64.14 61.77,64.14 L11.4-DIN
N$15
  Top 0.406: L9.2-DOUT 26.06,66.65 29.21,63.5 32.4,63.5
  Top 0.61: 32.4,63.5 L10.4-DIN
N$16
  Top 0.61: L5.2-DOUT 26.21,36.65 29.21,33.66 32.24,33.66 L6.4-DIN
N$17
  Top 0.61: L6.2-DOUT 57.33,36.65 60.33,33.66 62.24,33.66 L7.4-DIN
N$18
  Top 0.61: L7.2-DOUT 85.91,36.65 88.9,33.66 92.25,33.66 L8.4-DIN
N$19
  Top 0.406: R3.1 79.26,41.39 80.01,40.64 85.09,40.64 85.72,41.27 85.72,42.27
  Top 0.61: 85.72,42.27 X1.10
N$20
  Top 0.406: X1.11 87.5,43.63 86.36,44.45 69.64,44.45 R4.1
N$24
  Top 0.61: R5.2 92.2,60.45 91.44,59.69 91.44,57.56 X1.4
N$25
  Top 0.61: R5.1 97.38,57.62 X1.1
N$26  (via drill 0.6)
  Top 0.406: v54.01,21.38 53.97,20.18
  Top 0.61: 53.97,20.18 R1.2
  Bottom 0.61: D1.A 53.04,20.11 v54.01,21.38
N$27
  Top 1.676: J4.7 J4.9 4.76,85.41 5.71,86.36 J5.1
N$28  (via drill 0.6)
  Top 1.676: v53.34,83.19 v53.34,81.92 F1.1
  Bottom 1.676: J2.2 53.26,80.86 F1.1
  other vias: 53.34,80.78
OSH_LED  (via drill 0.6)
  Top 0.406: X1.7 85.5,55.66 v83.82,53.98 | v83.82,26.04 57.15,26.04 55.88,24.77 55.88,20.29
  Top 0.61: 55.88,20.29 R1.1
  Bottom 0.406: v83.82,53.98 v83.82,26.04
RX  (via drill 0.6)
  Top 0.406: J4.3 9.85,77.78 10.79,76.83 10.79,74.93 12.06,73.66 v87,73.66 | v95.25,49.53 95.5,48.65 X1.15 95.5,40.89 J6.3
  Bottom 0.406: J3.5 95.32,80.01 90.81,80.01 90.17,79.38 90.17,76.83 v87,73.66 87,51.44 88.9,49.53 v95.25,49.53
SCL  (via drill 0.6)
  Top 0.305: U1.4 68.42,49.06 69.02,48.46 U2.4
  Top 0.406: X1.13 91.5,46.93 90.17,48.26 v73.66,48.26 73.46,48.46 U2.4 | R6.1 73.48,52.88 v73.66,52.7
  Bottom 0.406: v73.66,52.7 v73.66,48.26
SDA
  Top 0.305: 76.2,50.8 74.93,50.8 74.49,50.36 U2.6 70.48,50.42 70.48,55.24 69.66,56.07 U1.3
  Top 0.406: X1.14 93.5,49.38 92.08,50.8 76.2,50.8 76.34,50.95 R7.1
TX  (via drill 0.6)
  Top 0.406: J4.5 10.48,80.33 12.06,78.74 12.06,76.2 13.34,74.61 v85.72,74.61 | v97.47,47.62 97.5,46.65 X1.16 97.5,40.35 J6.4
  Bottom 0.406: J3.3 95.32,82.55 90.17,82.55 88.9,81.28 88.9,78.11 v85.72,74.61 85.72,49.53 87.63,47.62 v97.47,47.62
VIN
  Top 0.813: D3.A 57.27,76.83
  Top 1.422: 95.31,75.56 J3.9
  Top 1.676: J3.7 J3.9 | J5.2 57.15,86.36 | 57.15,86.36 83.19,86.36 87,82.55 87,77.47 88.9,75.56 95.31,75.56 | 57.27,76.83 57.27,77.47 | 57.27,77.47 57.27,86.23 57.15,86.36 | F1.2 53.34,77.47 57.27,77.47

### Text on the board
tNames: Led Tile | V1.0 | (c) S.Harrison 4 June 2018 | http://ThingySticks.com/LedTile | https://github.com/ThingySticks/LedTile